# Altium project PMSM_Motor_Controller_v2_2023.PrjPcb (part 2 of 2)

## Sheet Encoder.SchDoc
size A4; SheetNumber: 6; SheetTotal: 7
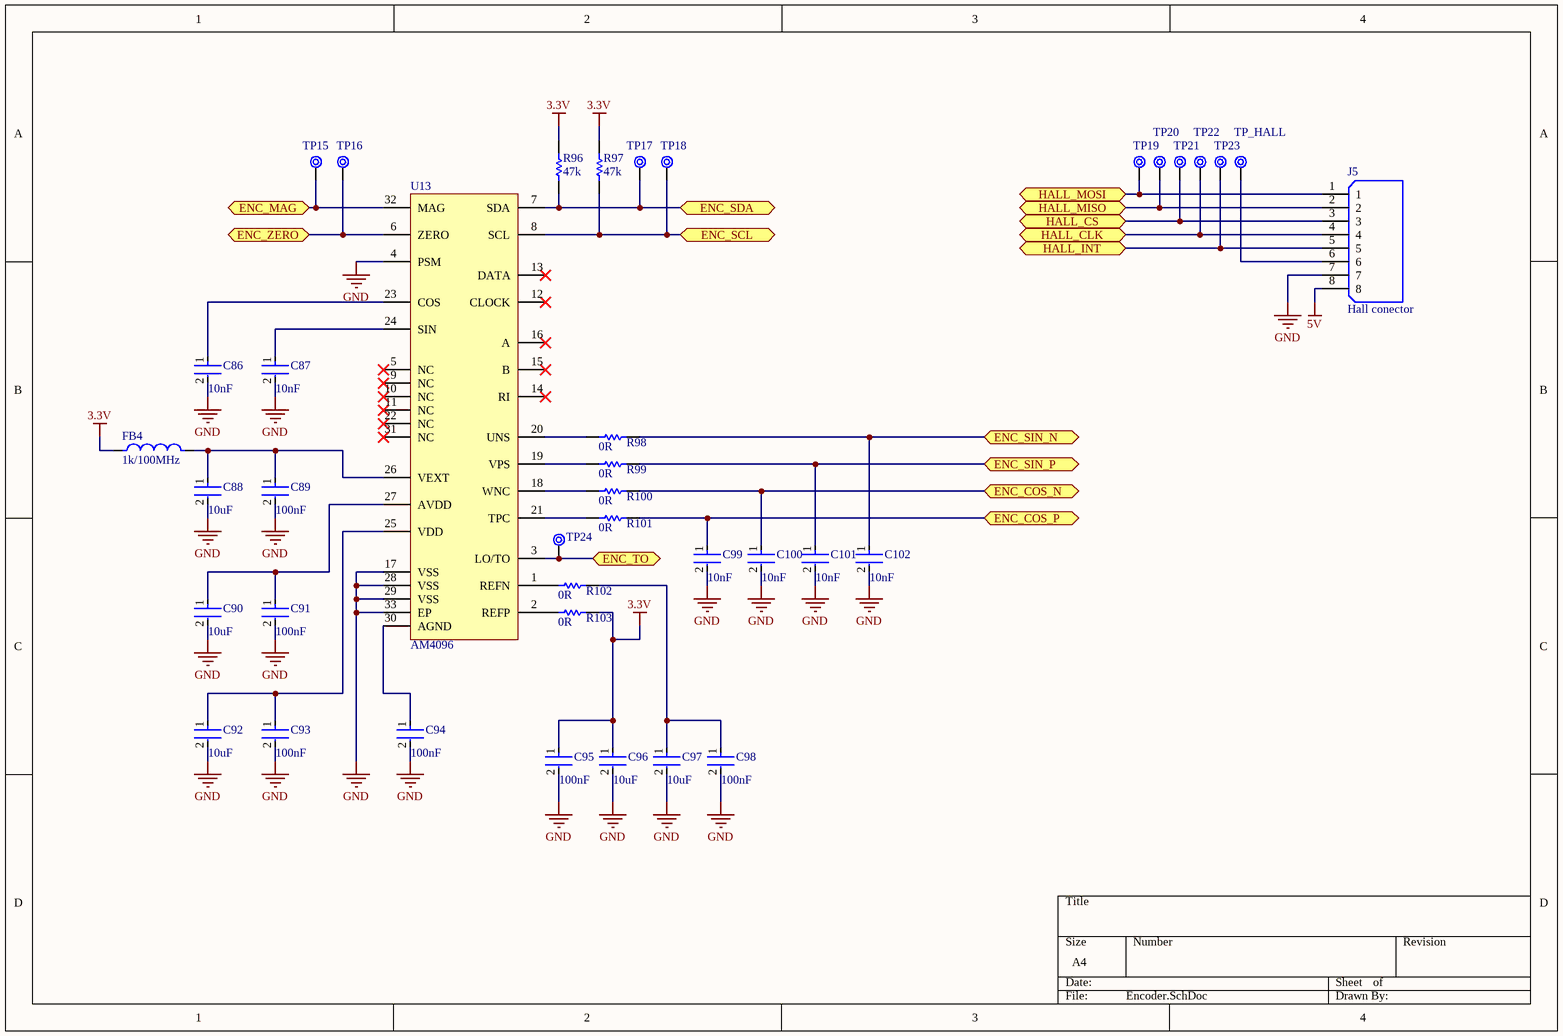
[diagram p5: Encoder.SchDoc]

### Parts
C86  10nF  [FP-C0805C-DN-MFG]
C87  10nF  [FP-C0805C-DN-MFG]
C88  10uF  [FP-C0805C-DN-MFG]
C89  100nF  [FP-C0805C-DN-MFG]
C90  10uF  [FP-C0805C-DN-MFG]
C91  100nF  [FP-C0805C-DN-MFG]
C92  10uF  [FP-C0805C-DN-MFG]
C93  100nF  [FP-C0805C-DN-MFG]
C94  100nF  [FP-C0805C-DN-MFG]
C95  100nF  [FP-C0805C-DN-MFG]
C96  10uF  [FP-C0805C-DN-MFG]
C97  10uF  [FP-C0805C-DN-MFG]
C98  100nF  [FP-C0805C-DN-MFG]
C99  10nF  [FP-C0805C-DN-MFG]
C100  10nF  [FP-C0805C-DN-MFG]
C101  10nF  [FP-C0805C-DN-MFG]
C102  10nF  [FP-C0805C-DN-MFG]
FB4  1k/100MHz  [FB_0603]
J5  Hall conector  [AMPHENOL_10114830-11108LF]
R96  47k  [RESC2013X50X30LL20T20]
R97  47k  [RESC2013X50X30LL20T20]
R98  0R  [RESC1609X50X30NL8T20]
R99  0R  [RESC1609X50X30NL8T20]
R100  0R  [RESC1609X50X30NL8T20]
R101  0R  [RESC1609X50X30NL8T20]
R102  0R  [RESC1609X50X30NL8T20]
R103  0R  [RESC1609X50X30NL8T20]
TP15  Test Point 1mm  [Pad 1mm]  (value not drawn)
TP16  Test Point 1mm  [Pad 1mm]  (value not drawn)
TP17  Test Point 1mm  [Pad 1mm]  (value not drawn)
TP18  Test Point 1mm  [Pad 1mm]  (value not drawn)
TP19  Test Point 1mm  [Pad 1mm]  (value not drawn)
TP20  Test Point 1mm  [Pad 1mm]  (value not drawn)
TP21  Test Point 1mm  [Pad 1mm]  (value not drawn)
TP22  Test Point 1mm  [Pad 1mm]  (value not drawn)
TP23  Test Point 1mm  [Pad 1mm]  (value not drawn)
TP24  Test Point 1mm  [Pad 1mm]  (value not drawn)
TP_HALL  Test Point 1mm  [Pad 1mm]  (value not drawn)
U13  AM4096  [QFN65P600X600X100_HS-33N]

### Ports
ENC_COS_N (bidir, see MCU[7B]), ENC_COS_P (bidir, see MCU[7B]), ENC_MAG (bidir, see MCU[5B]), ENC_SCL (bidir, see MCU[5B]), ENC_SDA (bidir, see MCU[7B]), ENC_SIN_N (bidir, see MCU[7A]), ENC_SIN_P (bidir, see MCU[7A]), ENC_TO (bidir, see MCU[7A]), ENC_ZERO (bidir, see MCU[5A]), HALL_CLK (bidir, see MCU[5A]), HALL_CS (bidir, see MCU[7A]), HALL_INT (bidir, see MCU[7B]), HALL_MISO (bidir, see MCU[5A]), HALL_MOSI (bidir, see MCU[5B])

### Nets
3.3V: C95.1 C96.1 FB4.1 R96.2 R97.2 R103.2
5V: J5.8
GND: C86.2 C87.2 C88.2 C89.2 C90.2 C91.2 C92.2 C93.2 C94.2 C95.2 C96.2 C97.2 C98.2 C99.2 C100.2 C101.2 C102.2 J5.7 U13.4(PSM) U13.17(VSS) U13.28(VSS) U13.29(VSS) U13.33(EP)
ENC_COS_N: C100.1 R100.2 ; port ENC_COS_N
ENC_COS_P: C99.1 R101.2 ; port ENC_COS_P
ENC_MAG: TP15.1 U13.32(MAG) ; port ENC_MAG
ENC_SCL: R97.1 TP18.1 U13.8(SCL) ; port ENC_SCL
ENC_SDA: R96.1 TP17.1 U13.7(SDA) ; port ENC_SDA
ENC_SIN_N: C102.1 R98.2 ; port ENC_SIN_N
ENC_SIN_P: C101.1 R99.2 ; port ENC_SIN_P
ENC_TO: TP24.1 U13.3(LO/TO) ; port ENC_TO
ENC_ZERO: TP16.1 U13.6(ZERO) ; port ENC_ZERO
HALL_CLK: J5.4 TP22.1 ; port HALL_CLK
HALL_CS: J5.3 TP21.1 ; port HALL_CS
HALL_INT: J5.5 TP23.1 ; port HALL_INT
HALL_MISO: J5.2 TP20.1 ; port HALL_MISO
HALL_MOSI: J5.1 TP19.1 ; port HALL_MOSI
NetC86_1: C86.1 U13.23(COS)
NetC87_1: C87.1 U13.24(SIN)
NetC88_1: C88.1 C89.1 FB4.2 U13.26(VEXT)
NetC90_1: C90.1 C91.1 U13.27(AVDD)
NetC92_1: C92.1 C93.1 U13.25(VDD)
NetC94_1: C94.1 U13.30(AGND)
NetC97_1: C97.1 C98.1 R102.2
NetJ5_6: J5.6 TP_HALL.1
NetR98_1: R98.1 U13.20(UNS)
NetR99_1: R99.1 U13.19(VPS)
NetR100_1: R100.1 U13.18(WNC)
NetR101_1: R101.1 U13.21(TPC)
NetR102_1: R102.1 U13.1(REFN)
NetR103_1: R103.1 U13.2(REFP)

Not connected (* = marked no-connect by the designer): U13 5(NC)* 9(NC)* 10(NC)* 11(NC)* 12(CLOCK)* 13(DATA)* 14(RI)* 15(B)* 16(A)* 22(NC)* 31(NC)*

### Library data of the parts
C86-C102 = CMP-2007-00279-2: CAP CER 0.1UF 50V X7R 0805; Manufacturer Part Number: C0805C104K5RACTU; Manufacturer: KEMET; Value: 0.10 μF; Tolerance: 0.1; Temperature Coefficient: 30ppm/°C; Material: Ceramic; Device Class L2: Capacitors; Temperature Range Low: -55°C; Voltage Rating: 50 V; Digikey Description: CAP CER 0.1UF 50V X7R 0805; Category: Cap; ComponentLink2Description: Datasheet; Octopart: https://octopart.com/c0805c104k5ractu-kemet-143926; RoHS: TRUE; ComponentLink2URL: https://content.kemet.com/datasheets/KEM_C1003_C0G_SMD.pdf; Temperature Characteristic: X7R; Temperature: -55°C to +125°C; Height: 0.88mm; Temperature Range High: +125°C; Device Class L1: Passive Components; Automotive: No; Lead Free: Yes; Ipc Land Pattern Name: CAPC200125X78; Device Class L3: Ceramic Capacitors; Mouser Description: Cap Ceramic 0.1uF 50V X7R 10% SMD 2.0 x 1.2 mm 125 C Paper T/R; Capacitance: 0.10 μF; Package: C0805C-DN
FB4 = FB/MMZ1608B102CTA00: Ferrite Beads 1K OHM 25%; Manufacturer: TDK; Distributor: Mouser; Distributor ID: 810-MMZ1608B102CTA00; Part Number: MMZ1608B102CTA00
J5 = 10114830-11108LF: 1.25mm Wire to Board Wafer, Right Angle, Surface Mount, 8 Positions; MF: Amphenol ICC; Package: None; Price: None; Check_prices: https://www.snapeda.com/parts/10114830-11108LF/Amphenol+FCI/view-part/?ref=eda; Value: *; SnapEDA_Link: https://www.snapeda.com/parts/10114830-11108LF/Amphenol+FCI/view-part/?ref=snap; MP: 10114830-11108LF; Availability: In Stock; Purchase-URL: https://pricing.snapeda.com/search?q=10114830-11108LF&ref=eda
R96 R97 = CMP-2001-04896-1: Manufacturer: Vishay Dale; Part Number: CRCW08050000Z0EA
R98-R103 = CMP-2000-03816-5: Chip Resistor, 0 Ohm, Jumper, 100 mW, -55 to 155 degC, 0603 (1608 Metric), RoHS, Tape and Reel; Manufacturer: Vishay Semiconductor; Voltage Rating: 75 V; Package Quantity: 5000; DatasheetVersion: 06/2012; Min Operating Temperature: -55 degC; ComponentLink1URL: http://www.vishay.com/; Mounting Technology: Surface Mount; Height: 0.45 mm; ComponentLink1Description: Manufacturer URL; REACH SVHC: Unknown; PackageReference: 0603; Packaging: Tape and Reel; Max Operating Temperature: 155 degC; Mount: Surface Mount; ComponentLink2Description: Datasheet; PackageDescription: 2-Pin Surface Mount Device, Body 1.575 x 0.85 mm; Length: 1.55 mm; ComponentLink2URL: http://www.vishay.com/docs/20035/dcrcwe3.pdf; Pins: 2; RoHSCompliant: true
U13 = AM4096: 12 bit Rotary Magnetic Encoder IC; Manufacturer: RLS; Distributor: RLS; Distributor ID: AM4096; Part Number: AM4096

## Sheet IMU.SchDoc
size A4; SheetNumber: 7; SheetTotal: 7
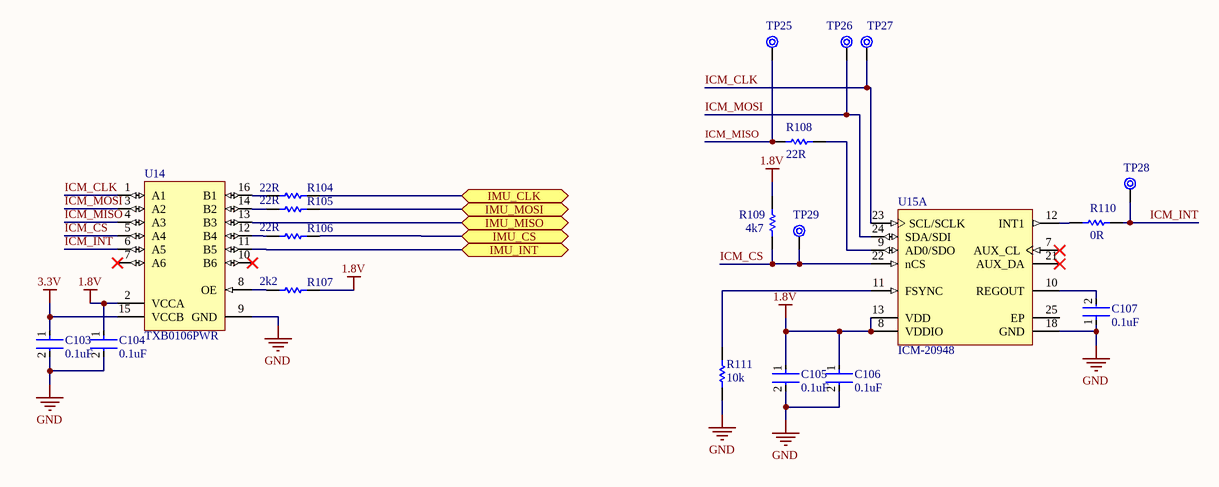
[diagram p6: IMU.SchDoc]

### Parts
C103  0.1uF  [FP-C0805C-DN-MFG]
C104  0.1uF  [FP-C0805C-DN-MFG]
C105  0.1uF  [FP-C0805C-DN-MFG]
C106  0.1uF  [FP-C0805C-DN-MFG]
C107  0.1uF  [FP-C0805C-DN-MFG]
R104  22R  [RESC2013X50X30LL20T20]
R105  22R  [RESC2013X50X30LL20T20]
R106  22R  [RESC2013X50X30LL20T20]
R107  2k2  [RESC2013X50X30LL20T20]
R108  22R  [RESC2013X50X30LL20T20]
R109  4k7  [RESC2013X50X30LL20T20]
R110  0R  [RESC1609X50X30NL8T20]
R111  10k  [RESC2013X50X30LL20T20]
TP25  Test Point 1mm  [Pad 1mm]  (value not drawn)
TP26  Test Point 1mm  [Pad 1mm]  (value not drawn)
TP27  Test Point 1mm  [Pad 1mm]  (value not drawn)
TP28  Test Point 1mm  [Pad 1mm]  (value not drawn)
TP29  Test Point 1mm  [Pad 1mm]  (value not drawn)
U14  TXB0106PWR  [PW0016A_L]
U15  ICM-20948  [TDK-QFN-24_L]  (part A of 2)

### Ports
IMU_CLK (bidir, see MCU[7A]), IMU_CS (bidir, see MCU[5B]), IMU_INT (bidir, see MCU[5B]), IMU_MISO (bidir, see MCU[7B]), IMU_MOSI (bidir, see MCU[5A])

### Nets
1.8V: C104.1 C105.1 C106.1 R107.2 R109.2 U14.2(VCCA) U15.8(VDDIO) U15.13(VDD)
3.3V: C103.1 U14.15(VCCB)
GND: C103.2 C104.2 C105.2 C106.2 C107.1 R111.1 U14.9(GND) U15.18(GND)
ICM_CLK: TP27.1 U14.1(A1) U15.23(SCL/SCLK)
ICM_CS: R109.1 TP29.1 U14.5(A4) U15.22(nCS)
ICM_INT: R110.2 TP28.1 U14.6(A5)
ICM_MISO: R108.1 TP25.1 U14.4(A3)
ICM_MOSI: TP26.1 U14.3(A2) U15.24(SDA/SDI)
IMU_CLK: R104.2 ; port IMU_CLK
IMU_CS: R106.2 ; port IMU_CS
IMU_INT: U14.11(B5) ; port IMU_INT
IMU_MISO: U14.13(B3) ; port IMU_MISO
IMU_MOSI: R105.2 ; port IMU_MOSI
NetC107_2: C107.2 U15.10(REGOUT)
NetR104_1: R104.1 U14.16(B1)
NetR105_1: R105.1 U14.14(B2)
NetR106_1: R106.1 U14.12(B4)
NetR107_1: R107.1 U14.8(OE)
NetR108_2: R108.2 U15.9(AD0/SDO)
NetR110_1: R110.1 U15.12(INT1)
NetR111_2: R111.2 U15.11(FSYNC)

Not connected (* = marked no-connect by the designer): U14 7(A6)* 10(B6)*; U15 7(AUX_CL)* 21(AUX_DA)* 25(EP)

### Library data of the parts
C103-C107 = CMP-2007-00279-2: as C86 on sheet Encoder; Device Class L2: Capacitors; Temperature Range Low: -55°C; Voltage Rating: 50 V; Digikey Description: CAP CER 0.1UF 50V X7R 0805; Category: Cap; ComponentLink2Description: Datasheet; Octopart: https://octopart.com/c0805c104k5ractu-kemet-143926; RoHS: TRUE; ComponentLink2URL: https://content.kemet.com/datasheets/KEM_C1003_C0G_SMD.pdf; Temperature Characteristic: X7R; Temperature: -55°C to +125°C; Height: 0.88mm; Temperature Range High: +125°C; Device Class L1: Passive Components; Automotive: No; Lead Free: Yes; Ipc Land Pattern Name: CAPC200125X78; Device Class L3: Ceramic Capacitors; Mouser Description: Cap Ceramic 0.1uF 50V X7R 10% SMD 2.0 x 1.2 mm 125 C Paper T/R; Capacitance: 0.10 μF; Package: C0805C-DN
R104-R109 R111 = CMP-2001-04896-1: 0805; Manufacturer: Vishay Dale; Part Number: CRCW08050000Z0EA
R110 = CMP-2000-03816-5: as R98 on sheet Encoder; Package Quantity: 5000; DatasheetVersion: 06/2012; Min Operating Temperature: -55 degC; ComponentLink1URL: http://www.vishay.com/; Mounting Technology: Surface Mount; Height: 0.45 mm; ComponentLink1Description: Manufacturer URL; REACH SVHC: Unknown; PackageReference: 0603; Packaging: Tape and Reel; Max Operating Temperature: 155 degC; Mount: Surface Mount; ComponentLink2Description: Datasheet; PackageDescription: 2-Pin Surface Mount Device, Body 1.575 x 0.85 mm; Length: 1.55 mm; ComponentLink2URL: http://www.vishay.com/docs/20035/dcrcwe3.pdf; Pins: 2; RoHSCompliant: true
U14 = CMP-2000-07336-1: 6-Bit Bidirectional Level-Shifting and Voltage Translator with Auto-Direction Sensing and +/- 15-kV ESD Protection, 1.2 to 3.6 V, -40 to 85 degC, 16-Pin TSSOP (PW), Green (RoHS & no Sb/Br), Tape and Reel; Manufacturer: Texas Instruments; Dynamic Catalog: TXBSeries; Differential - Input: Output:No/No; Number of Bits: 6; Output Type: Logic; Propagation Delay (Max): 4ns; Number of Outputs/Channel: 1; Voltage - Supply: 1.2V~3.6V,1.65V~5.5V; Data Rate: 100Mbps; Product Training Modules: VoltageLevelTranslation; Other Names: 296-23759-1; Logic Function: Translator,Bidirectional; Packaging: CutTape(CT); Datasheet URL: http://www.ti.com/general/docs/lit/getliterature.tsp?genericPartNumber=TXB0106&fileType=pdf; Package Description: 16-Pin Small Outline Package Integrated Circuit, Body 5 x 4.4 mm, Pitch 0.65 mm; Standard Package: 1; Series: -; Manufacturer URL: http://www.ti.com/; Operating Temperature: -40°C~85°C; Supplier Device Package: 16-TSSOP; Package Reference: PW16; Number of Channels: 6; Category: IntegratedCircuits(ICs); Package / Case: 16-TSSOP(0.173",4.40mmWidth); Family: Logic-Translators; Datasheet Version: Rev. B, 06/2015; Mounting Technology: SurfaceMount; Input Type: Logic
U15 = CMP-2000-07532-1: World’s Lowest Power 9-Axis MEMS MotionTracking(TM) Device, 1.71 to 3.6 V, -40 to 85 degC, 24-Pin QFN, RoHS, Tape and Reel; Manufacturer: TDK; Package Description: 24-Pin Quad Flat No-lead Package, Body 3 x 3 mm, Pitch 0.4 mm; Datasheet Version: Rev. 1.3, 06/2017; Package Reference: QFN-24; Mounting Technology: SurfaceMount; Datasheet URL: https://www.invensense.com/wp-content/uploads/2016/06/DS-000189-ICM-20948-v1.3.pdf; Manufacturer URL: http://www.tdk.com/

## Nets that join several sheets
1.8V: Power_Supply (C20.2 C21.2 U4.2), IMU (8 pins)
3.3V: Power_Supply (C16.2 C17.2 U3.2), MCU (15 pins), ECAT0_(IN) (11 pins), ECAT1_(OUT) (10 pins), MOSFET (R86.1), Encoder (6 pins), IMU (C103.1 U14.15)
5V: Power_Supply (C12.2 C13.2 U2.2), MOSFET (5 pins), Encoder (J5.8)
10V: Power_Supply (14 pins), MOSFET (C71.1 U10.4)
+48V_CON: Power_Supply (C1.2 C2.2 D1.1 J1.1), MOSFET (Q1.D Q3.D Q5.D)
GND: Power_Supply (27 pins), MCU (31 pins), ECAT0_(IN) (22 pins), ECAT1_(OUT) (22 pins), MOSFET (10 pins), Encoder (23 pins), IMU (8 pins)
GND_C: Power_Supply (5 pins), MOSFET (14 pins)
GND_CHASIS: ECAT0_(IN) (C53.1 C54.2 J3.MH1 J3.MH2), ECAT1_(OUT) (C69.1 C70.2 J4.MH1 J4.MH2)
BEMF_A: MCU (U5.23), MOSFET (C75.2 R69.1 R70.1 TP7.1)
BEMF_B: MCU (U5.22), MOSFET (C76.2 R71.1 R72.1 TP8.1)
BEMF_C: MCU (U5.21), MOSFET (C77.2 R73.1 R74.1 TP9.1)
CURR_SENSE_OUT1: MCU (U5.26), MOSFET (TP11.1 U12.2)
CURR_SENSE_OUT2: MCU (U5.27), MOSFET (TP12.1 U12.8)
CURR_SENSE_OUT3: MCU (U5.28), MOSFET (TP13.1 U12.13)
CURR_SENSE_OUT4: MCU (U5.29), MOSFET (TP14.1 U12.19)
ECAT_IN_LINK: MCU (U5.68), ECAT0_(IN) (R35.1 U6.22)
ECAT_IN_LINK_ACT: MCU (U5.71), ECAT0_(IN) (R36.1)
ECAT_IN_RX_CLK: MCU (U5.78), ECAT0_(IN) (R21.1)
ECAT_IN_RX_DV: MCU (U5.80), ECAT0_(IN) (U6.32)
ECAT_IN_RX_ER: MCU (U5.54), ECAT0_(IN) (U6.34)
ECAT_IN_RXD0: MCU (U5.58), ECAT0_(IN) (R25.1)
ECAT_IN_RXD1: MCU (U5.57), ECAT0_(IN) (R24.1)
ECAT_IN_RXD2: MCU (U5.56), ECAT0_(IN) (R23.1)
ECAT_IN_RXD3: MCU (U5.55), ECAT0_(IN) (R22.1)
ECAT_IN_TX_CLK: MCU (U5.79), ECAT0_(IN) (R15.1)
ECAT_IN_TX_EN: MCU (U5.76), ECAT0_(IN) (R16.1)
ECAT_IN_TXD0: MCU (U5.83), ECAT0_(IN) (R17.1)
ECAT_IN_TXD1: MCU (U5.82), ECAT0_(IN) (R18.1)
ECAT_IN_TXD2: MCU (U5.81), ECAT0_(IN) (R19.1)
ECAT_IN_TXD3: MCU (U5.77), ECAT0_(IN) (R20.1)
ECAT_OUT_LINK: MCU (U5.18), ECAT1_(OUT) (R58.1 U8.22)
ECAT_OUT_LINK_ACT: MCU (U5.95), ECAT1_(OUT) (R59.1)
ECAT_OUT_RX_CLK: MCU (U5.1), ECAT1_(OUT) (R45.1)
ECAT_OUT_RX_DV: MCU (U5.4), ECAT1_(OUT) (U8.32)
ECAT_OUT_RX_ER: MCU (U5.19), ECAT1_(OUT) (U8.34)
ECAT_OUT_RXD0: MCU (U5.24), ECAT1_(OUT) (R49.1)
ECAT_OUT_RXD1: MCU (U5.96), ECAT1_(OUT) (R48.1)
ECAT_OUT_RXD2: MCU (U5.97), ECAT1_(OUT) (R47.1)
ECAT_OUT_RXD3: MCU (U5.98), ECAT1_(OUT) (R46.1)
ECAT_OUT_TX_CLK: MCU (U5.3), ECAT1_(OUT) (R39.1)
ECAT_OUT_TX_EN: MCU (U5.7), ECAT1_(OUT) (R40.1)
ECAT_OUT_TXD0: MCU (U5.6), ECAT1_(OUT) (R41.1)
ECAT_OUT_TXD1: MCU (U5.5), ECAT1_(OUT) (R42.1)
ECAT_OUT_TXD2: MCU (U5.100), ECAT1_(OUT) (R43.1)
ECAT_OUT_TXD3: MCU (U5.99), ECAT1_(OUT) (R44.1)
ECAT_PHY_CLK25: MCU (R10.2 U5.70), ECAT0_(IN) (U6.28), ECAT1_(OUT) (U8.28)
ECAT_PHY_MCLK: MCU (U5.93), ECAT0_(IN) (U6.25), ECAT1_(OUT) (U8.25)
ECAT_PHY_MDO: MCU (U5.94), ECAT0_(IN) (U6.24), ECAT1_(OUT) (U8.24)
ECAT_PHY_RST: MCU (C38.2 R9.1 U5.44), ECAT0_(IN) (U6.23), ECAT1_(OUT) (U8.23)
ENC_COS_N: MCU (U5.36), Encoder (C100.1 R100.2)
ENC_COS_P: MCU (U5.37), Encoder (C99.1 R101.2)
ENC_MAG: MCU (U5.2), Encoder (TP15.1 U13.32)
ENC_SCL: MCU (U5.88), Encoder (R97.1 TP18.1 U13.8)
ENC_SDA: MCU (U5.74), Encoder (R96.1 TP17.1 U13.7)
ENC_SIN_N: MCU (U5.30), Encoder (C102.1 R98.2)
ENC_SIN_P: MCU (U5.31), Encoder (C101.1 R99.2)
ENC_TO: MCU (U5.20), Encoder (TP24.1 U13.3)
ENC_ZERO: MCU (U5.52), Encoder (TP16.1 U13.6)
GATE_DRV_HA: MCU (U5.53), MOSFET (TP1.1 U10.22)
GATE_DRV_HB: MCU (U5.50), MOSFET (TP2.1 U10.23)
GATE_DRV_HC: MCU (U5.49), MOSFET (TP3.1 U10.24)
GATE_DRV_LA: MCU (U5.46), MOSFET (TP4.1 U10.1)
GATE_DRV_LB: MCU (U5.45), MOSFET (TP5.1 U10.2)
GATE_DRV_LC: MCU (U5.40), MOSFET (TP6.1 U10.3)
HALL_CLK: MCU (U5.48), Encoder (J5.4 TP22.1)
HALL_CS: MCU (U5.84), Encoder (J5.3 TP21.1)
HALL_INT: MCU (U5.75), Encoder (J5.5 TP23.1)
HALL_MISO: MCU (U5.47), Encoder (J5.2 TP20.1)
HALL_MOSI: MCU (U5.91), Encoder (J5.1 TP19.1)
IMU_CLK: MCU (U5.85), IMU (R104.2)
IMU_CS: MCU (U5.90), IMU (R106.2)
IMU_INT: MCU (U5.92), IMU (U14.11)
IMU_MISO: MCU (U5.69), IMU (U14.13)
IMU_MOSI: MCU (U5.41), IMU (R105.2)
N_P: MCU (U5.25), MOSFET (C78.2 R78.1 R79.1 TP10.1)